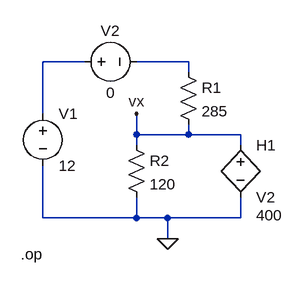
[diagram p0: schematic ccvs.asc]
ccvs.asc, the LTspice schematic file:
Version 4
SHEET 1 880 680
WIRE 16 64 -48 64
WIRE 176 64 96 64
WIRE 176 80 176 64
WIRE -48 144 -48 64
WIRE 96 176 96 144
WIRE 176 176 176 160
WIRE 176 176 96 176
WIRE 256 176 176 176
WIRE 96 192 96 176
WIRE 256 192 256 176
WIRE -48 304 -48 224
WIRE 96 304 96 272
WIRE 96 304 -48 304
WIRE 144 304 96 304
WIRE 256 304 256 272
WIRE 256 304 144 304
WIRE 144 336 144 304
FLAG 144 336 0
FLAG 96 144 vx
SYMBOL res 160 64 R0
SYMATTR InstName R1
SYMATTR Value 285
SYMBOL res 80 176 R0
SYMATTR InstName R2
SYMATTR Value 120
SYMBOL voltage -48 128 R0
WINDOW 123 0 0 Left 0
WINDOW 39 0 0 Left 0
SYMATTR InstName V1
SYMATTR Value 12
SYMBOL h 256 176 R0
WINDOW 123 24 124 Left 2
SYMATTR InstName H1
SYMATTR Value V2
SYMATTR Value2 400
SYMBOL voltage 0 64 R270
WINDOW 0 32 56 VTop 2
WINDOW 3 -32 56 VBottom 2
WINDOW 123 0 0 Left 0
WINDOW 39 0 0 Left 0
SYMATTR InstName V2
SYMATTR Value 0
TEXT -82 360 Left 2 !.op

The netlist it stands for:
* ccvs.asc
R1 N002 vx 285
R2 vx 0 120
V1 N001 0 12
H1 vx 0 V2 400
V2 N001 N002 0
.op
.backanno
.end